# Altium project KCInput_Attenuator_V0.2.PrjPcb
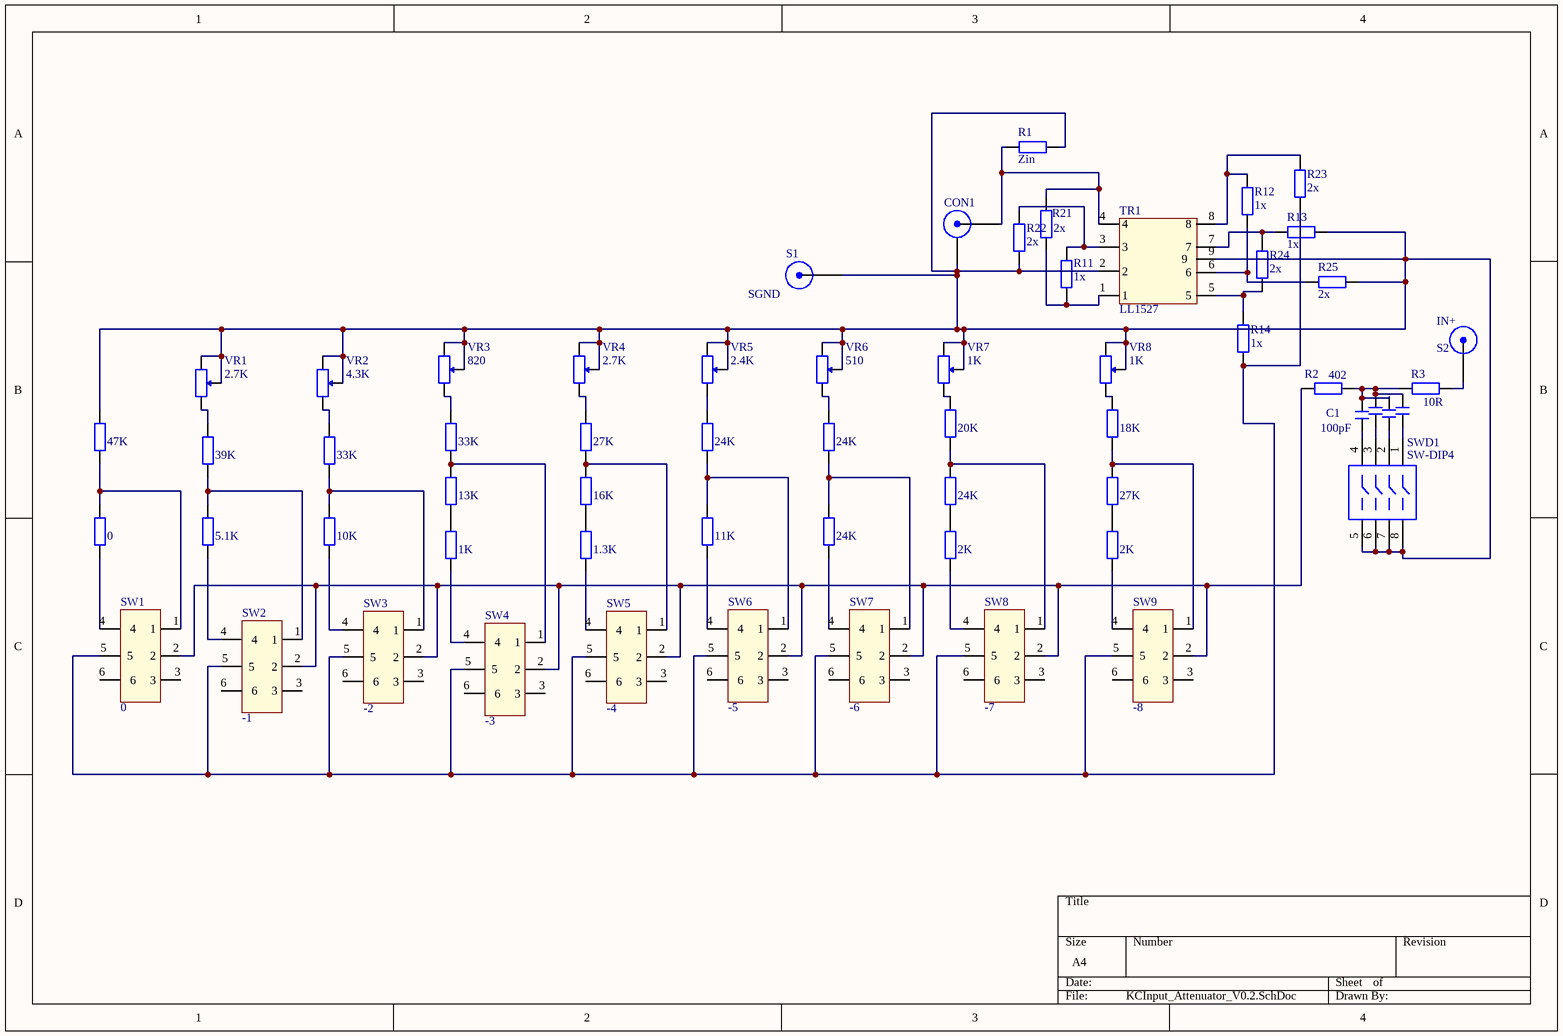
[diagram p0: KCInput_Attenuator_V0.2.SchDoc]
1 sheet, 60 parts. Net scope: global (net labels, ports and power ports of the same name join across sheets).
Board file: KCInput_Attenuator_V0.2.PcbDoc

## Sheet KCInput_Attenuator_V0.2.SchDoc
size A4

### Parts
C1  100pF  [CBB 6.3*6.3*5]
C2  100pF  [CBB 6.3*6.3*5]  (value not drawn)
C3  100pF  [CBB 6.3*6.3*5]  (value not drawn)
C4  20pF  [CBB 6.3*6.3*5]  (value not drawn)
CON1  RCA  [RCA-RJ255]  (value not drawn)
R1  Zin  [RS 1/4W]
R2  402  [RS 1/4W]
R3  10R  [RS 1/4W]
R11  1x  [RS 1/4W]
R12  1x  [RS 1/4W]
R13  1x  [RS 1/4W]
R14  1x  [RS 1/4W]
R21  2x  [RS 1/4W]
R22  2x  [RS 1/4W]
R23  2x  [RS 1/4W]
R24  2x  [RS 1/4W]
R25  2x  [RS 1/4W]
R41  0  [RS 1/4W]
R42  47K  [RS 1/4W]
R43  5.1K  [RS 1/4W]
R44  39K  [RS 1/4W]
R45  10K  [RS 1/4W]
R46  33K  [RS 1/4W]
R47  13K  [RS 1/4W]
R48  33K  [RS 1/4W]
R49  16K  [RS 1/4W]
R50  27K  [RS 1/4W]
R51  11K  [RS 1/4W]
R52  24K  [RS 1/4W]
R53  24K  [RS 1/4W]
R54  24K  [RS 1/4W]
R55  24K  [RS 1/4W]
R56  20K  [RS 1/4W]
R57  27K  [RS 1/4W]
R58  18K  [RS 1/4W]
R471  1K  [RS 1/4W]
R491  1.3K  [RS 1/4W]
R551  2K  [RS 1/4W]
R571  2K  [RS 1/4W]
S1  SGND  [Screw-M2-s]
S2  IN+  [Screw-M2-s]
SW1  0  [Swich_3x2]
SW2  -1  [Swich_3x2]
SW3  -2  [Swich_3x2]
SW4  -3  [Swich_3x2]
SW5  -4  [Swich_3x2]
SW6  -5  [Swich_3x2]
SW7  -6  [Swich_3x2]
SW8  -7  [Swich_3x2]
SW9  -8  [Swich_3x2]
SWD1  SW-DIP4  [DIP-8]
TR1  LL1527  [LL1527]
VR1  2.7K  [RS 1/2W-VR]
VR2  4.3K  [RS 1/2W-VR]
VR3  820  [RS 1/2W-VR]
VR4  2.7K  [RS 1/2W-VR]
VR5  2.4K  [RS 1/2W-VR]
VR6  510  [RS 1/2W-VR]
VR7  1K  [RS 1/2W-VR]
VR8  1K  [RS 1/2W-VR]

### Nets
NetC1_1: C1.1 SWD1.4
NetC1_2: C1.2 C2.2 C3.2 C4.2 R2.2 R3.1
NetC2_1: C2.1 SWD1.3
NetC3_1: C3.1 SWD1.2
NetC4_1: C4.1 SWD1.1
NetCON1_1: CON1.1(X) R1.1 R21.2 TR1.4
NetCON1_2: CON1.2(Y) R1.2 R13.2 R22.1 R25.2 R42.2 S1.1(X) SWD1.5 SWD1.6 SWD1.7 SWD1.8 TR1.2 TR1.9 VR1.1 VR1.3 VR2.1 VR2.3 VR3.1 VR3.3 VR4.1 VR4.3 VR5.1 VR5.3 VR6.1 VR6.3 VR7.1 VR7.3 VR8.1 VR8.3
NetR2_1: R2.1 SW1.2 SW2.2 SW3.2 SW4.2 SW5.2 SW6.2 SW7.2 SW8.2 SW9.2
NetR3_2: R3.2 S2.1(X)
NetR11_1: R11.1 R21.1 TR1.1
NetR11_2: R11.2 R22.2 TR1.3
NetR12_1: R12.1 R25.1 TR1.6
NetR12_2: R12.2 R23.2 TR1.8
NetR13_1: R13.1 R24.2 TR1.7
NetR14_1: R14.1 R23.1 SW1.5 SW2.5 SW3.5 SW4.5 SW5.5 SW6.5 SW7.5 SW8.5 SW9.5
NetR14_2: R14.2 R24.1 TR1.5
NetR41_1: R41.1 SW1.4
NetR41_2: R41.2 R42.1 SW1.1
NetR43_1: R43.1 SW2.4
NetR43_2: R43.2 R44.1 SW2.1
NetR44_2: R44.2 VR1.2
NetR45_1: R45.1 SW3.4
NetR45_2: R45.2 R46.1 SW3.1
NetR46_2: R46.2 VR2.2
NetR47_1: R47.1 R471.2
NetR47_2: R47.2 R48.1 SW4.1
NetR48_2: R48.2 VR3.2
NetR49_1: R49.1 R491.2
NetR49_2: R49.2 R50.1 SW5.1
NetR50_2: R50.2 VR4.2
NetR51_1: R51.1 SW6.4
NetR51_2: R51.2 R52.1 SW6.1
NetR52_2: R52.2 VR5.2
NetR53_1: R53.1 SW7.4
NetR53_2: R53.2 R54.1 SW7.1
NetR54_2: R54.2 VR6.2
NetR55_1: R55.1 R551.2
NetR55_2: R55.2 R56.1 SW8.1
NetR56_2: R56.2 VR7.2
NetR57_1: R57.1 R571.2
NetR57_2: R57.2 R58.1 SW9.1
NetR58_2: R58.2 VR8.2
NetR471_1: R471.1 SW4.4
NetR491_1: R491.1 SW5.4
NetR551_1: R551.1 SW8.4
NetR571_1: R571.1 SW9.4

Not connected (* = marked no-connect by the designer): SW1 3 6; SW2 3 6; SW3 3 6; SW4 3 6; SW5 3 6; SW6 3 6; SW7 3 6; SW8 3 6; SW9 3 6

### Library data of the parts
C1-C4 = C-CBB: CBB电容; 版权归属: 源创客; BOM名称: CBB电容; 学习资源: www.ooocke.com
CON1 = RCA: RCA Connector; Revision: 17-Jul-2002: Re-released for DXP Platform.; Publisher: Altium Limited
R1-R3 R11-R14 R21-R25 R41-R58 R471 R491 R551 R571 = R-CRR: 直插色环电阻; BOM名称: 色环电阻; 版权归属: 源创客; 学习资源: www.ooocke.com
S1 S2 = ScrewConnector: Screw Connector
SW1-SW9 = Switch_3x2: Switch 3 pin 2 level
SWD1 = SW-DIP4: DIP Switch; Published: 24-Mar-1999; LatestRevisionDate: 17-Jul-2002; LatestRevisionNote: Re-released for DXP Platform.; PackageReference: DIP-8; Publisher: Altium Limited
TR1 = LL1527: Lundahl LL1527
VR1-VR8 = VR-W: 直插可调电阻-顶调